# EAGLE design Arduino_Zero (EAGLE 9.6.2)
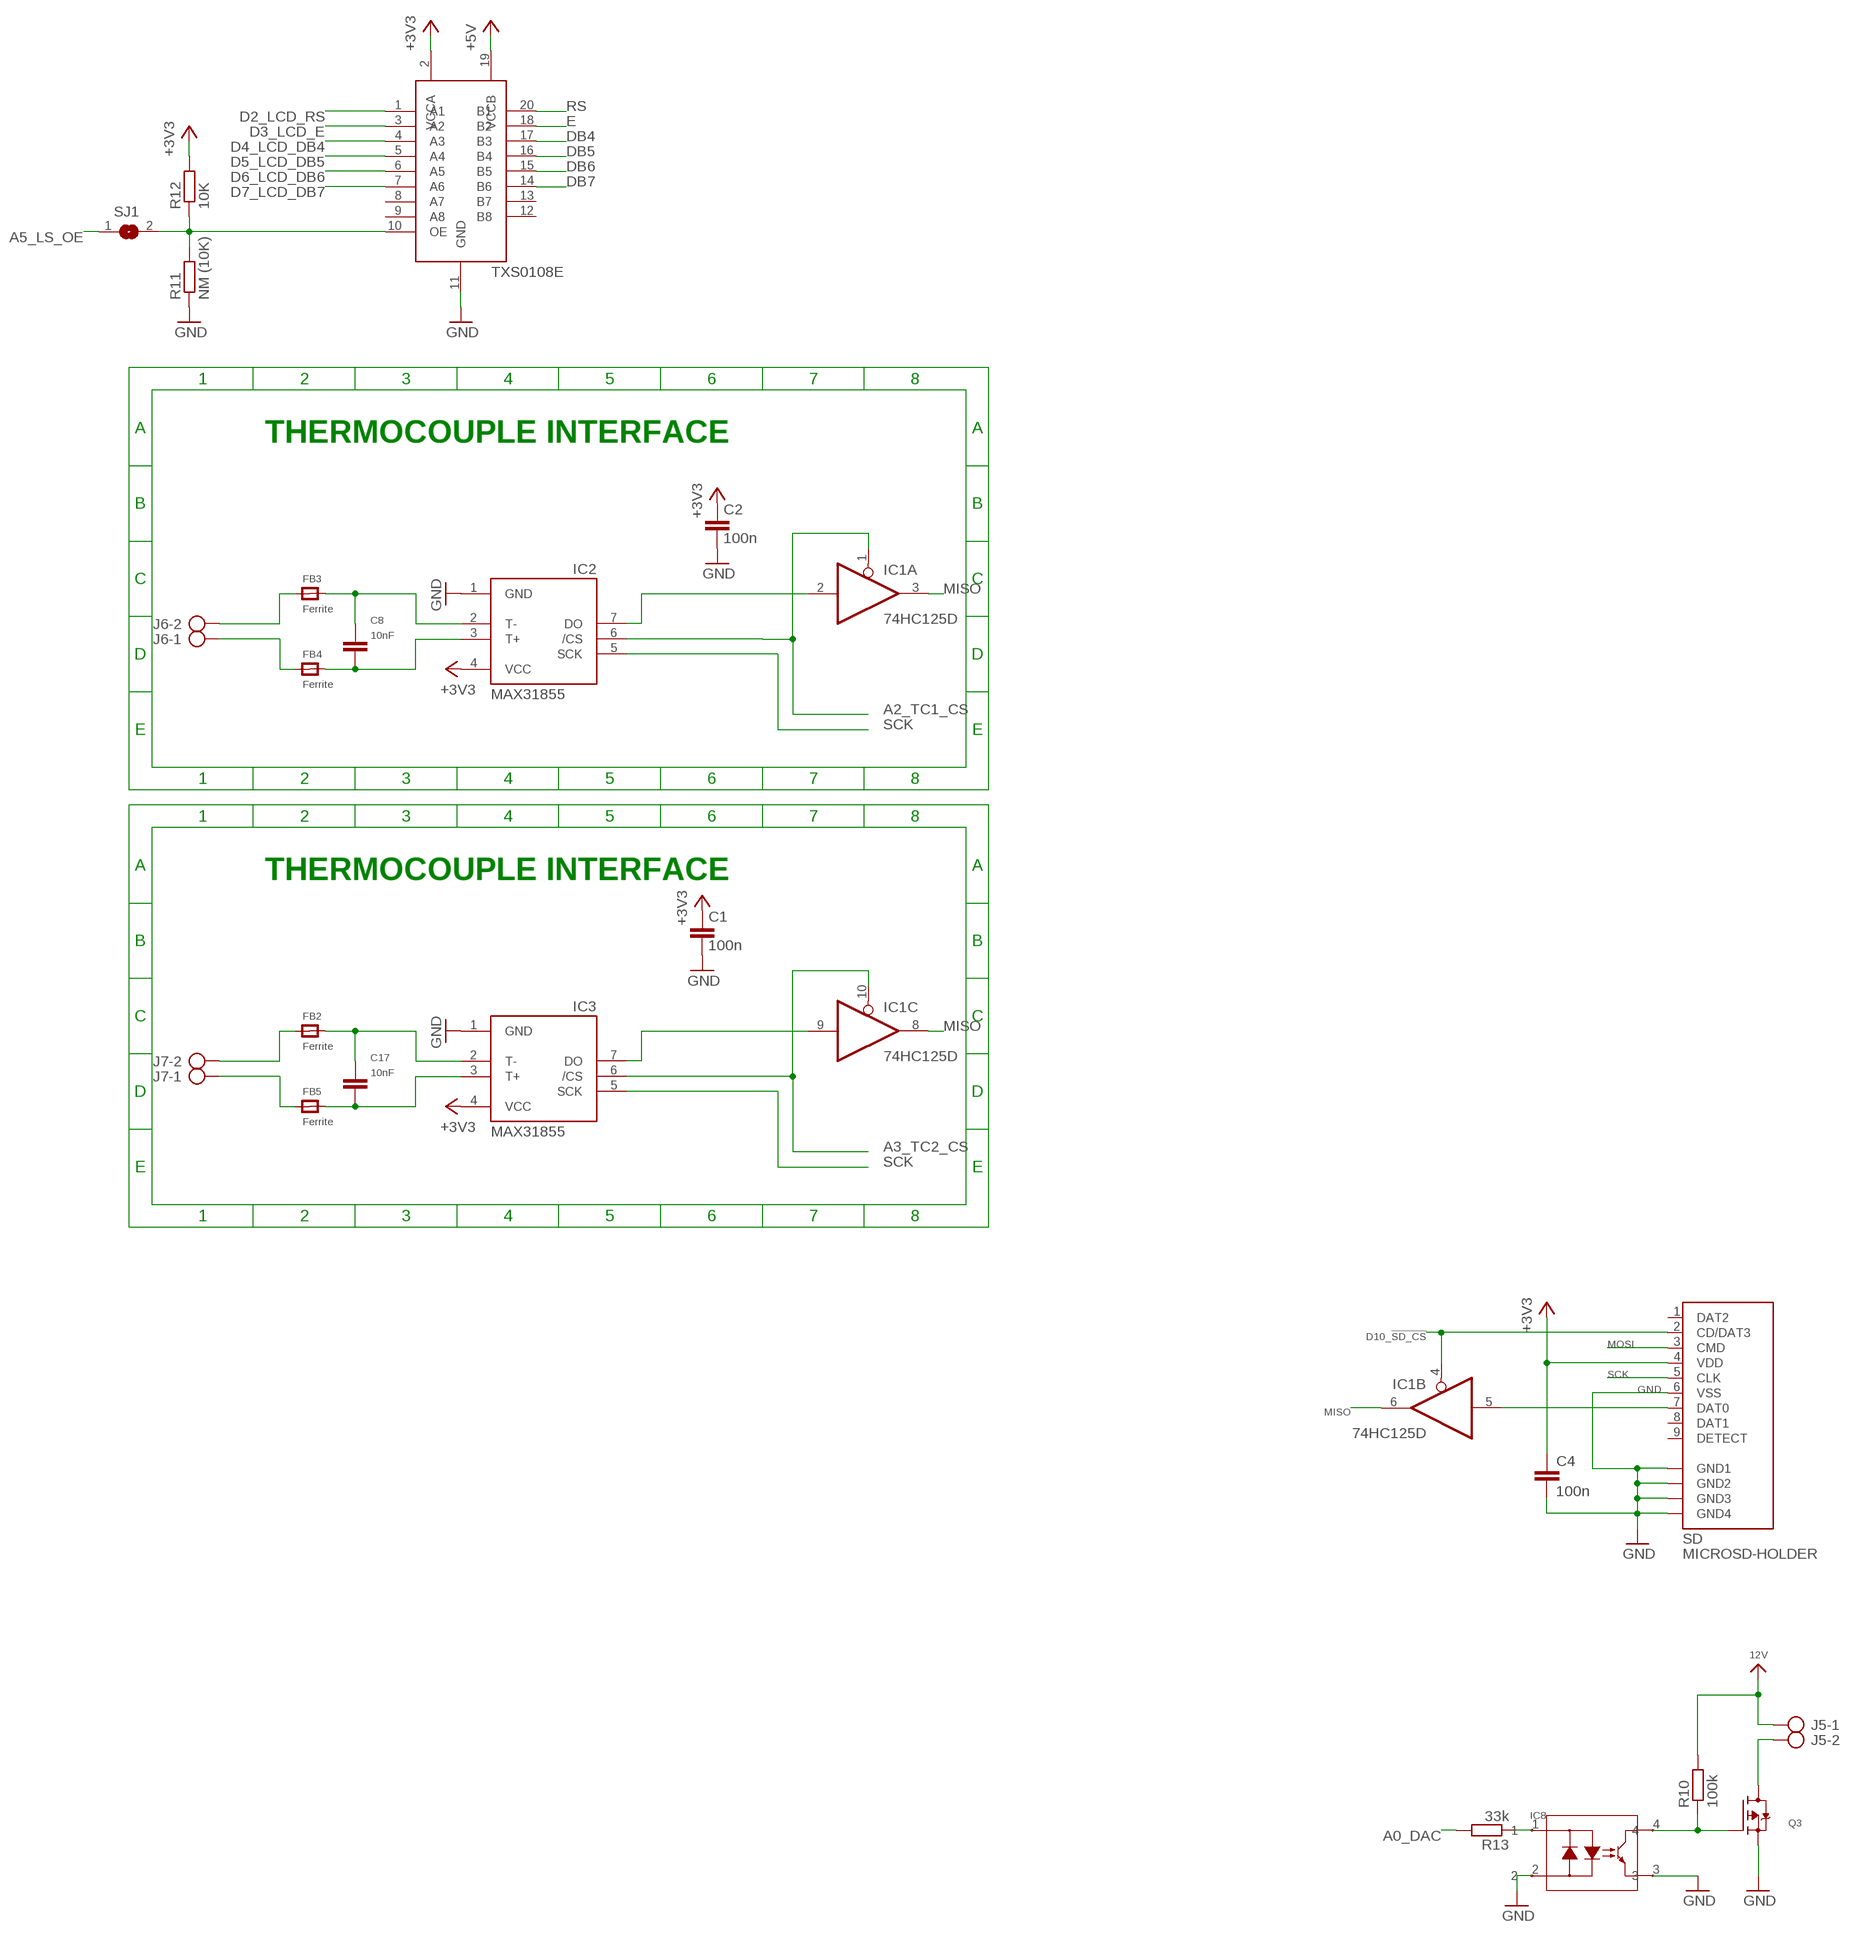
[diagram p0: schematic, sheet 1, part 1 of 2]
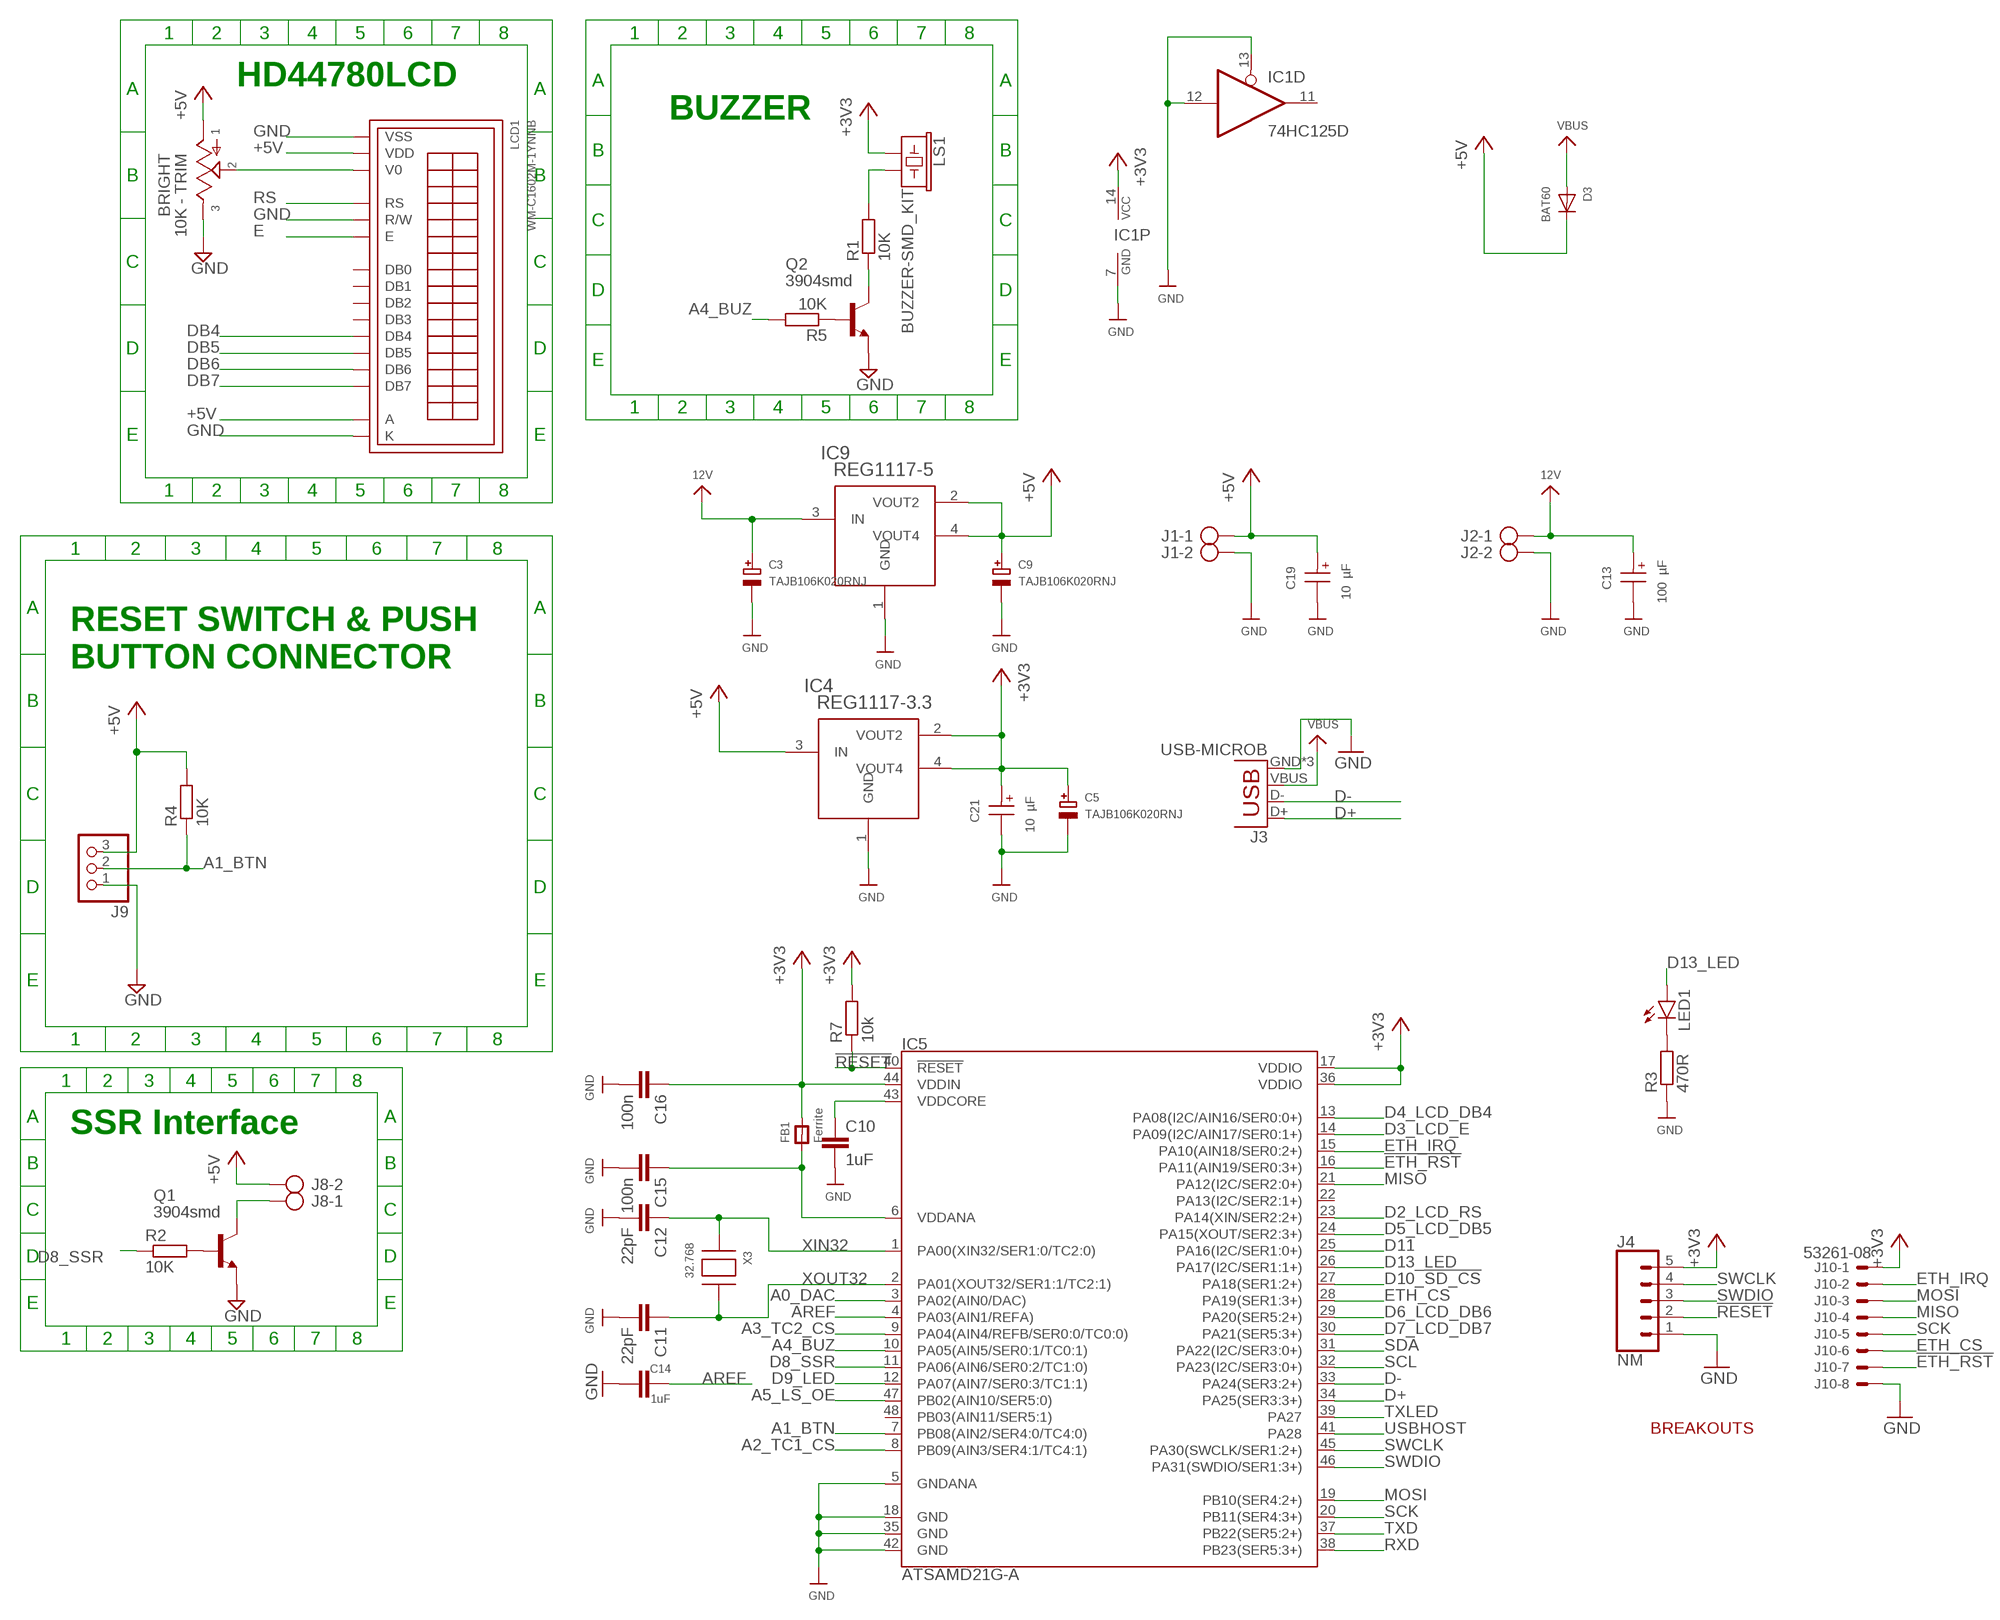
[diagram p1: schematic, sheet 1, part 2 of 2]

## Parts
BRIGHT  10K - TRIM  POTTRIM  [B25P]
C1  100n  C-EUC0603K  [C0603K]
C2  100n  C-EUC0603K  [C0603K]
C3  TAJB106K020RNJ  CAP_TANTALUM  [CAPMP3528X210N]
C4  100n  C-EUC0603K  [C0603K]
C5  TAJB106K020RNJ  CAP_TANTALUM  [CAPMP3528X210N]
C8  10nF  C-EUC0603K  [C0603K]
C9  TAJB106K020RNJ  CAP_TANTALUM  [CAPMP3528X210N]
C10  1uF  C-EUC0603K  [C0603K]
C11  22pF  C-EUC0603K  [C0603K]
C12  22pF  C-EUC0603K  [C0603K]
C13  100 µF  WCAP-ASLI_6.3X7.7_865080545012  [WCAP-ASLI_6.3X7.7(DXL)]
C14  1uF  C-EUC0603K  [C0603K]
C15  100n  C-EUC0603K  [C0603K]
C16  100n  C-EUC0603K  [C0603K]
C17  10nF  C-EUC0603K  [C0603K]
C19  10 µF  WCAP-ASLI_4X5.5_865080340001  [WCAP-ASLI_4X5.5(DXL)]
C21  10 µF  WCAP-ASLI_4X5.5_865080340001  [WCAP-ASLI_4X5.5(DXL)]
D3  BAT60  DIODESOD-323-3D  [SOD323]
FB1  Ferrite  FERRITEBEAD  [BEADC3216X100N]
FB2  Ferrite  FERRITEBEAD  [BEADC3216X100N]
FB3  Ferrite  FERRITEBEAD  [BEADC3216X100N]
FB4  Ferrite  FERRITEBEAD  [BEADC3216X100N]
FB5  Ferrite  FERRITEBEAD  [BEADC3216X100N]
IC1  74HC125D  [SO14]
IC2  MAX31855  MAX6675  [SO08]
IC3  MAX31855  MAX6675  [SO08]
IC4  REG1117-3.3  REG1117-5  [DCY0004A_N]
IC5  ATSAMD21G-A  [TQFP-48]
IC7  TXS0108E  [TSSOP20]
IC8  TLP283  TLP292  [SO4_TOS]
IC9  REG1117-5  [DCY0004A_N]
J1  AK500/2ASD  [AK500/2]
J2  AK500/2ASD  [AK500/2]
J3  USB-MICROB  [USB-MICROB]
J4  NM  CONN_051.27MM  [1X05_1.27MM]
J5  AK500/2ASD  [AK500/2]
J6  AK500/2ASD  [AK500/2]
J7  AK500/2ASD  [AK500/2]
J8  AK500/2ASD  [AK500/2]
J9  PINHD-1X3  [1X03]
J10  53261-08  [53261-08]
LCD1  WM-C1602M-1YNNB  [LCD_2]
LED1  LEDCHIPLED_0805  [CHIPLED_0805]
LS1  BUZZER-SMD_KIT  [BUZZER-CCV-KIT]
Q1  3904smd  BC850SMD  [SOT23-BEC]
Q2  3904smd  BC850SMD  [SOT23-BEC]
Q3  MOSFET-PWIDE  [SOT23-WIDE]
R1  10K  R-EU_R0603  [R0603]
R2  10K  R-EU_R0603  [R0603]
R3  470R  R-EU_R0603  [R0603]
R4  10K  R-EU_R0603  [R0603]
R5  10K  R-EU_R0603  [R0603]
R7  10k  R-EU_R0603  [R0603]
R10  100k  R-EU_R0603  [R0603]
R11  NM (10K)  R-EU_R0603  [R0603]
R12  10K  R-EU_R0603  [R0603]
R13  33k  R-EU_R0603  [R0603]
SD  MICROSD-HOLDER  [MICROSD-HOLDER-ALIEX]
SJ1  SJ  [SJ]
X3  32.768  XTAL-3.2X1.5  [XTAL3215]

## Nets
12V: C3.1(+) C13.1(+) IC9.3(IN) J2.1 J5.1 R10.2
!ETH_RST: IC5.16(PA11(AIN19/SER0:3+)) J10.7
!RESET: IC5.40(!RESET!) J4.2 R7.1
+3V3: C1.1 C2.1 C4.1 C5.1(+) C16.1 C21.1(+) FB1.2 IC1.14(P:VCC) IC2.4(VCC) IC3.4(VCC) IC4.2(VOUT2) IC4.4(VOUT4) IC5.17(VDDIO) IC5.36(VDDIO) IC5.44(VDDIN) IC7.2(VCCA) J4.5 J10.1 LS1.+ R7.2 R12.2 SD.4(VDD)
+5V: BRIGHT.1 C9.1(+) C19.1(+) D3.1(C) IC4.3(IN) IC7.19(VCCB) IC9.2(VOUT2) IC9.4(VOUT4) J1.1 J8.2 J9.3 LCD1.2(VDD) LCD1.15(A) R4.2
A0_DAC: IC5.3(PA02(AIN0/DAC)) R13.2
A1_BTN: IC5.7(PB08(AIN2/SER4:0/TC4:0)) J9.2 R4.1
A2_TC1_CS: IC1.1(A:OE) IC2.6(/CS) IC5.8(PB09(AIN3/SER4:1/TC4:1))
A3_TC2_CS: IC1.10(C:OE) IC3.6(/CS) IC5.9(PA04(AIN4/REFB/SER0:0/TC0:0))
A4_BUZ: IC5.10(PA05(AIN5/SER0:1/TC0:1)) R5.2
A5_LS_OE: IC5.47(PB02(AIN10/SER5:0)) SJ1.1
AREF: C14.1 IC5.4(PA03(AIN1/REFA))
D2_LCD_RS: IC5.23(PA14(XIN/SER2:2+)) IC7.1(A1)
D3_LCD_E: IC5.14(PA09(I2C/AIN17/SER0:1+)) IC7.3(A2)
D4_LCD_DB4: IC5.13(PA08(I2C/AIN16/SER0:0+)) IC7.4(A3)
D5_LCD_DB5: IC5.24(PA15(XOUT/SER2:3+)) IC7.5(A4)
D6_LCD_DB6: IC5.29(PA20(SER5:2+)) IC7.6(A5)
D7_LCD_DB7: IC5.30(PA21(SER5:3+)) IC7.7(A6)
D8_SSR: IC5.11(PA06(AIN6/SER0:2/TC1:0)) R2.1
D9_LED: IC5.12(PA07(AIN7/SER0:3/TC1:1))
D10_!SD_CS: IC1.4(B:OE) IC5.27(PA18(SER1:2+)) SD.2(CD/DAT3)
D11: IC5.25(PA16(I2C/SER1:0+))
D13_LED: IC5.26(PA17(I2C/SER1:1+)) LED1.A
D+: IC5.34(PA25(SER3:3+)) J3.D+
D-: IC5.33(PA24(SER3:2+)) J3.D-
DB4: IC7.17(B3) LCD1.11(DB4)
DB5: IC7.16(B4) LCD1.12(DB5)
DB6: IC7.15(B5) LCD1.13(DB6)
DB7: IC7.14(B6) LCD1.14(DB7)
E: IC7.18(B2) LCD1.6(E)
ETH_CS: IC5.28(PA19(SER1:3+)) J10.6
ETH_IRQ: IC5.15(PA10(AIN18/SER0:2+)) J10.2
GND: BRIGHT.3 C1.2 C2.2 C3.2(-) C4.2 C5.2(-) C9.2(-) C10.2 C11.2 C12.2 C13.2(-) C14.2 C15.2 C16.2 C19.2(-) C21.2(-) IC1.7(P:GND) IC1.12(D:I) IC1.13(D:OE) IC2.1(GND) IC3.1(GND) IC4.1(GND) IC5.5(GNDANA) IC5.18(GND) IC5.35(GND) IC5.42(GND) IC7.11(GND) IC8.2 IC8.3 IC9.1(GND) J1.2 J2.2 J3.GND J3.MT1(GND) J3.MT2(GND) J4.1 J9.1 J10.8 LCD1.1(VSS) LCD1.5(R/W) LCD1.16(K) Q1.E Q2.E Q3.2(S) R3.1 R11.1 SD.6(VSS) SD.P$1(GND1) SD.P$2(GND2) SD.P$3(GND3) SD.P$4(GND4)
MISO: IC1.3(A:O) IC1.6(B:O) IC1.8(C:O) IC5.21(PA12(I2C/SER2:0+)) J10.4
MOSI: IC5.19(PB10(SER4:2+)) J10.3 SD.3(CMD)
N$1: Q2.B R5.1
N$2: J8.1 Q1.C
N$3: Q1.B R2.2
N$4: LS1.- R1.2
N$5: BRIGHT.2 LCD1.3(V0)
N$6: LED1.C R3.2
N$7: IC1.2(A:I) IC2.7(DO)
N$8: IC1.5(B:I) SD.7(DAT0)
N$9: J5.2 Q3.3(D)
N$10: IC7.10(OE) R11.2 R12.1 SJ1.2
N$11: FB2.1 J7.2
N$12: IC8.1 R13.1
N$13: C17.1 FB2.2 IC3.2(T-)
N$14: IC8.4 Q3.1(G) R10.1
N$15: FB5.1 J7.1
N$16: C17.2 FB5.2 IC3.3(T+)
N$17: Q2.C R1.1
N$18: IC1.9(C:I) IC3.7(DO)
N$20: FB3.1 J6.2
N$21: C8.1 FB3.2 IC2.2(T-)
N$22: FB4.1 J6.1
N$27: C8.2 FB4.2 IC2.3(T+)
N$32: C15.1 FB1.1 IC5.6(VDDANA)
N$36: C10.1 IC5.43(VDDCORE)
RS: IC7.20(B1) LCD1.4(RS)
RXD: IC5.38(PB23(SER5:3+))
SCK: IC2.5(SCK) IC3.5(SCK) IC5.20(PB11(SER4:3+)) J10.5 SD.5(CLK)
SCL: IC5.32(PA23(I2C/SER3:0+))
SDA: IC5.31(PA22(I2C/SER3:0+))
SWCLK: IC5.45(PA30(SWCLK/SER1:2+)) J4.4
SWDIO: IC5.46(PA31(SWDIO/SER1:3+)) J4.3
TXD: IC5.37(PB22(SER5:2+))
TXLED: IC5.39(PA27)
USBHOST: IC5.41(PA28)
VBUS: D3.2(A) J3.VBUS
XIN32: C12.1 IC5.1(PA00(XIN32/SER1:0/TC2:0)) X3.P$1
XOUT32: C11.1 IC5.2(PA01(XOUT32/SER1:1/TC2:1)) X3.P$2
Unconnected: IC1.11(D:O) IC5.22(PA13(I2C/SER2:1+)) IC5.48(PB03(AIN11/SER5:1)) IC7.8(A7) IC7.9(A8) IC7.12(B8) IC7.13(B7) LCD1.7(DB0) LCD1.8(DB1) LCD1.9(DB2) LCD1.10(DB3) SD.1(DAT2) SD.8(DAT1) SD.9(DETECT)

## Notes on the sheet
- TXS0108E
- HD44780LCD
- BUZZER
- THERMOCOUPLE INTERFACE
- THERMOCOUPLE INTERFACE
- RESET SWITCH & PUSH
  BUTTON CONNECTOR
- SSR Interface
- BREAKOUTS

## Library data of the parts
BRIGHT = gm-pots:POT: Potentiometers the arrow indicates the clockwise motion of th wiper (lug 2) fully counter clockwise there is no resistance between lugs 1 and 2 fully clockwise the resistance between lugs 1 and 2 is the value of the pot
C1 C2 C4 C8 C10-C12 C14-C17 = rcl:C-EU: CAPACITOR, European symbol; SPICEPREFIX: C
C3 C5 C9 = microbuilder:CAP_TANTALUM: Tantalum Capacitors Wave footprints have larger pads and are meant to be used for hand soldering. Reflow footprints are optimised for solder paste and a reflow oven. EIA3216-18/A-[R/W] - Size A / 3216-18 / 1206 footprint 4.7µF 25V 10% Tantalum Capacitor 10µF 16V 10% Tantalum Capacitor [Digikey: 495-2236-2-ND] EIA3528-21/B-[R/W] - Size B / 3528-21 47µF 10V 10% Tantalum Capactior [Digikey: 495-2216-1-ND] EIA6032-28/C-[R/W] - Size C / 6032-28 10µF 35V 20% Tantalum Capacitor [Digikey: 495-2285-1-ND] 100µF 16V 10% Tantalum Capactior [Digikey: 399-5214-1-ND]
C13 = Wurth_Capacitors_WCAP-ASLI:WCAP-ASLI_6.3X7.7: WCAP-ASLI Aluminium Electrolytic Capacitors Low Impedance +105 °C Characteristics Low impedance product series Mounting style: V-Chip SMT Capacitance range: 0.1 µF ‒ 6800 µF Capacitance tolerance: ±20 % Voltage range (UR): 6.3 ‒ 100 V(DC) Operating temperature: -55 °C up to +105 °C Endurance: 2000 h @ +105 °C Dimensions (DxL) in mm: 4.0 x 5.5 up to 16.0 x 17.0 Recommended soldering: Reflow soldering Applications Low impedance, especially for filtering applications Input and output capacitor for switched-mode power supply Filtering Smoothing e.g. DC/DC converter, AC/DC converter, satellite receiver, control panel <https://www.we-online.com/catalog/media/o14723v209%20Family_WCAP-ASLI.jpg> Details see: https://www.we-online.com/catalog/en/WCAP-ASLI/ Updated by yingchun,Shan;2020-03-03 2020(C) Würth Elektronik; DATASHEET-URL: https://www.we-online.com/catalog/datasheet/865080545012.pdf; DF: 14%; DIAMETER: 6.3mm; I-LEAK: 35uA; I-RIPPLE: 300mA; L: 7.7mm; OPERATING-TEMPERATURE: -55 °C up to +105 °C; PART-NUMBER: 865080545012; TECHNICAL-REFERENCE: ASED077101M035DVCTCB000; VR: 35V(DC)
C19 C21 = Wurth_Capacitors_WCAP-ASLI:WCAP-ASLI_4X5.5: WCAP-ASLI Aluminium Electrolytic Capacitors Low Impedance +105 °C Characteristics Low impedance product series Mounting style: V-Chip SMT Capacitance range: 0.1 µF ‒ 6800 µF Capacitance tolerance: ±20 % Voltage range (UR): 6.3 ‒ 100 V(DC) Operating temperature: -55 °C up to +105 °C Endurance: 2000 h @ +105 °C Dimensions (DxL) in mm: 4.0 x 5.5 up to 16.0 x 17.0 Recommended soldering: Reflow soldering Applications Low impedance, especially for filtering applications Input and output capacitor for switched-mode power supply Filtering Smoothing e.g. DC/DC converter, AC/DC converter, satellite receiver, control panel <https://www.we-online.com/catalog/media/o14723v209%20Family_WCAP-ASLI.jpg> Details see: https://www.we-online.com/catalog/en/WCAP-ASLI/ Updated by yingchun,Shan;2020-03-02 2020(C) Würth Elektronik; DATASHEET-URL: https://www.we-online.com/catalog/datasheet/865080340001.pdf; DF: 16%; DIAMETER: 4mm; I-LEAK: 3uA; I-RIPPLE: 80mA; L: 5.5mm; OPERATING-TEMPERATURE: -55 °C up to +105 °C; PART-NUMBER: 865080340001; TECHNICAL-REFERENCE: ASEB055100M016DVCTAB000; VR: 16V(DC)
D3 = adafruit:DIODE: Diode SMADIODE - SMA Surface Mount Package 20V 1A Schottky Diode Digikey: 641-1014-6-ND DO-1N4148 - Through Hole Small Current Diode SOD-123 20V 1 A (.5mV Vf) Schottky Diode - Digikey: MBRX120TPMSCT-ND SOD-323 10V 570mA (.38mV Vf, 3ns) Schottky Diode - Digikey: ZLLS410CT-ND SOD-523 30V 30mA Schottky Diode (RB751S-40TE61) - Digikey: RB751S-40TE61CT-ND SOT23-R/W - SOT23 Package (R = Solder Paste/Reflow Ovens, W = Hand-Soldering) BAT54Film 40V 300mA - Digikey: 497-7162-1-ND
FB1-FB5 = microbuilder:FERRITE: Ferrite Bead 0603 MMZ1608B121C - 120 Ohm @ 100MHz, 600mA, 0.15 Ohm DC Resistance - Digikey: 445-2164-1-ND BK1608HW121-T - 120 Ohm, 600mA Ferrite Chip - Digikey: 587-1876-2-ND 0805 HZ0805B272R-10 - 2.7K Ohm @ 100MHz, 200mA, 0.8 Ohm DC Resistance - Digikey: 240-2504-1-ND (see also Murata BLM21BD272SN1L) MMZ2012Y152B - 1.5K Ohm @ 100MHz, 500mA, 0.4 Ohm DC Resistance - Digikey: 445-1560-1-ND - Mainly for high frequency (80-400MHz) MMZ2012R102A - 1K Ohm @ 100MHz, 500mA, 0.3 Ohm DC Resistance - Digikey: 445-1555-2-ND - More general purpose (10-200MHz)
IC1 = 74xx-eu:74*125: Quad bus BUFFER, 3-state
IC2 IC3 = adafruit:MAX6675
IC4 IC9 = gfe-hand-made:REG1117-5; COPYRIGHT: Copyright (C) 2022 Ultra Librarian. All rights reserved.; MANUFACTURER_PART_NUMBER: TLV1117-33CDCYR; MFR_NAME: Texas Instruments; REFDES: RefDes; TYPE: TYPE
IC5 = SparkFun-DigitalIC:ATSAMD21G: Atmel SAMD21G SMART ARM-Based Microcontroller The Atmel ® | SMART ™ SAM D21 is a series of low-power microcontrollers using the 32-bit ARM ® Cortex ® -M0+ processor, and ranging from 32- to 64-pins with up to 256KB Flash and 32KB of SRAM. The SAM D21 devices operate at a maximum frequency of 48MHz and reach 2.46 CoreMark/MHz. They are designed for simple and intuitive migration with identical peripheral modules, hex compatible code, identical linear address map and pin compatible migration paths between all devices in the product series. All devices include intelligent and flexible peripherals, Atmel Event System for inter-peripheral signaling, and support for capacitive touch button, slider and wheel user interfaces.; PROD_ID: IC-13064
IC7 = Synapseware:TXS0108E: 8-BIT BIDIRECTIONAL VOLTAGE-LEVEL TRANSLATOR FOR OPEN-DRAIN AND PUSH-PULL APPLICATIONS
IC8 = gfe-hand-made:TLP292; COPYRIGHT: Copyright (C) 2022 Ultra Librarian. All rights reserved.; MANUFACTURER_PART_NUMBER: TLP292; MFR_NAME: Toshiba Electronic Devices & Storage Co.
J1 J2 J5-J8 = con-ptr500:AK500/2: CONNECTOR
J3 = SparkFun-Connectors:USB: USB Connectors USB-B-PTH is fully proven SKU : PRT-00139/CONN-08278 USB-miniB is fully proven SKU : PRT-00587 USB-A-PCB is untested. USB-A-H is throughly reviewed, but untested. Spark Fun Electronics SKU : PRT-00437 USB-B-SMT is throughly reviewed, but untested. Needs silkscreen touching up. USB-A-S has not been used/tested USB-MB-H has not been used/tested USB-MICROB has been used. CONN-09505; PROD_ID: CONN-09505
J4 = SparkFun-Connectors:CONN_05: Multi connection point. Often used as Generic Header-pin footprint for 0.1 inch spaced/style header connections On any of the 0.1 inch spaced packages, you can populate with these: Break Away Headers - Straight <https://www.sparkfun.com/products/116> (PRT-00116) Break Away Male Headers - Right Angle <https://www.sparkfun.com/products/553> (PRT-00553) Female Headers <https://www.sparkfun.com/products/115> (PRT-00115) Break Away Headers - Machine Pin <https://www.sparkfun.com/products/117> (PRT-00117) Break Away Female Headers - Swiss Machine Pin <https://www.sparkfun.com/products/743> (PRT-00743) For SCREWTERMINALS and SPRING TERMINALS visit here: Screw Terimnals on SparkFun.com <https://www.sparkfun.com/search/results?term=Screw+Terminals> (5mm/3.5mm/2.54mm spacing) This device is also useful as a general connection point to wire up your design to another part of your project. Our various solder wires solder well into these plated through hole pads. Hook-Up Wire - Assortment (Stranded, 22 AWG) <https://www.sparkfun.com/products/11375> (PRT-11375) Hook-Up Wire - Assortment (Solid Core, 22 AWG) <https://www.sparkfun.com/products/11367> (PRT-11367) View the entire wire category on our website here <https://www.sparkfun.com/categories/141> Special notes: Molex polarized connector foot print use with SKU : PRT-08231 with associated crimp pins and housings. 1MM SMD Version SKU: PRT-10208
J9 = adafruit:PINHD-1X3: PIN HEADER
J10 = con-molex:53?-08: CONNECTOR wire to board 1.25 mm (.049 inch) pitch header; MF: MOLEX; OC_FARNELL: 1125376; OC_NEWARK: unknown
LCD1 = lcd:WM-C1602M-1YNNB: Display a cristalli liquidi tipo WM-C1602M WINTEK http://www.....
LED1 = led:LED: LED OSRAM: - CHIPLED LG R971, LG N971, LY N971, LG Q971, LY Q971, LO R971, LY R971 LH N974, LH R974 LS Q976, LO Q976, LY Q976 LO Q996 - Hyper CHIPLED LW Q18S LB Q993, LB Q99A, LB R99A - SideLED LS A670, LO A670, LY A670, LG A670, LP A670 LB A673, LV A673, LT A673, LW A673 LH A674 LY A675 LS A676, LA A676, LO A676, LY A676, LW A676 LS A679, LY A679, LG A679 - Hyper Micro SIDELED® LS Y876, LA Y876, LO Y876, LY Y876 LT Y87S - SmartLED LW L88C, LW L88S LB L89C, LB L89S, LG L890 LS L89K, LO L89K, LY L89K LS L896, LA L896, LO L896, LY L896 - TOPLED LS T670, LO T670, LY T670, LG T670, LP T670 LSG T670, LSP T670, LSY T670, LOP T670, LYG T670 LG T671, LOG T671, LSG T671 LB T673, LV T673, LT T673, LW T673 LH T674 LS T676, LA T676, LO T676, LY T676, LB T676, LH T676, LSB T676, LW T676 LB T67C, LV T67C, LT T67C, LS T67K, LO T67K, LY T67K, LW E67C LS E67B, LA E67B, LO E67B, LY E67B, LB E67C, LV E67C, LT E67C LW T67C LS T679, LY T679, LG T679 LS T770, LO T770, LY T770, LG T770, LP T770 LB T773, LV T773, LT T773, LW T773 LH T774 LS E675, LA E675, LY E675, LS T675 LS T776, LA T776, LO T776, LY T776, LB T776 LHGB T686 LT T68C, LB T68C - Hyper Mini TOPLED® LB M676 - Mini TOPLED Santana® LG M470 LS M47K, LO M47K, LY M47K Source: http://www.osram.convergy.de LUXEON: - LUMILED® LXK2-PW12-R00, LXK2-PW12-S00, LXK2-PW14-U00, LXK2-PW14-V00 LXK2-PM12-R00, LXK2-PM12-S00, LXK2-PM14-U00 LXK2-PE12-Q00, LXK2-PE12-R00, LXK2-PE12-S00, LXK2-PE14-T00, LXK2-PE14-U00 LXK2-PB12-K00, LXK2-PB12-L00, LXK2-PB12-M00, LXK2-PB14-N00, LXK2-PB14-P00, LXK2-PB14-Q00 LXK2-PR12-L00, LXK2-PR12-M00, LXK2-PR14-Q00, LXK2-PR14-R00 LXK2-PD12-Q00, LXK2-PD12-R00, LXK2-PD12-S00 LXK2-PH12-R00, LXK2-PH12-S00 LXK2-PL12-P00, LXK2-PL12-Q00, LXK2-PL12-R00 Source: www.luxeon.com KINGBRIGHT: KA-3528ASYC Source: www.kingbright.com
LS1 = SparkFun-Electromechanical:BUZZER: Buzzer Small round buzzers that operate around the audible 2kHz range. You can use these as speakers to create simple music or user interfaces. Variant Overview: PTH - Mini Speaker - PC Mount 12mm 2.048kHz <https://www.sparkfun.com/products/7950> PTH_KIT - Mini Speaker - PC Mount 12mm 2.048kHz <https://www.sparkfun.com/products/7950> KIT simplifies soldering by adding stop mask to one side of the pads. PTH_NO_SILK - Mini Speaker - PC Mount 12mm 2.048kHz <https://www.sparkfun.com/products/7950> No silkscreen indicator of buzzer outline. PTH_KIT_NO_SILK - Mini Speaker - PC Mount 12mm 2.048kHz <https://www.sparkfun.com/products/7950> KIT package w/o silkscreen SMD - Buzzer Audio Magnetic (CCV-084B16) SMD buzzer used on, e.g. the LilyPad Buzzer <https://www.sparkfun.com/products/8463> and RFID USB Reader <https://www.sparkfun.com/products/9963>. SMD_KIT - Buzzer Audio Magnetic (CCV-084B16) SMD Buzzer with elongated pins to make soldering easier. Used on the SparkFun Simon Says - Surface Mount Soldering Kit <https://www.sparkfun.com/products/10935>.; PROD_ID: COMP-08568
Q1 Q2 = transistor-npn:BC850*: NPN Transistor
Q3 = microbuilder:MOSFET-P: P-Channel Mosfet LEGEND VDS: Voltage Drain-Source ID: Drain Current RDS(ON): Drain-Source On-State Resistance VGS(TH): Gate-Source Threshold Voltage CISS: Drain-Source Input Capacitance SOT-23 Name VDS ID RDS(ON) VGS(TH) CISS Order Number IRLML5103 30V 760mA 600 mOhm -- 75pF @ 25V Digikey: IRLML5103PBFCT-ND IRLML6401 12V 4.3A 50 mOhm 950mV @ 250µA 830pF @ 10V Digikey: IRLML6401PBFTR-ND NTR0202PL 20V 400mA 800 mOhm 2.3V @ 250uA 70pF @ 5V Digikey: NTR0202PLT1GOSTR-ND NTR4101PT1G 20V 1.8A 85 mOhm 1.2V @ 250uA 675pF @ 10V Digikey: NTR4101PT1GOSCT-ND DMP2004K 20V 600mA 900 mOhm 1V @ 250uA 175pF @ 16V Digikey: DMP2004KDICT-ND PMV65XP 20V 3.9A 76 mOhm 950mV @ 1mA 725pF @ 20V Digikey: 568-2358-2-ND TO-252 Name VDS ID RDS(ON) VGS(TH) CISS Order Number AOD417 30V 25A 34 mOhm 3V @ 250µA 920pF @ 15V Digikey: 785-1106-2-ND
R1-R5 R7 R10-R13 = rcl:R-EU_: RESISTOR, European symbol; SPICEPREFIX: R
SD = gfe-hand-made:MICROSD-HOLDER
SJ1 = jumper:SJ: SMD solder JUMPER
X3 = adafruit2:XTAL: Low cost SMT crystals, no capacitors included http://www.ladyada.net/library/eagle

## Board
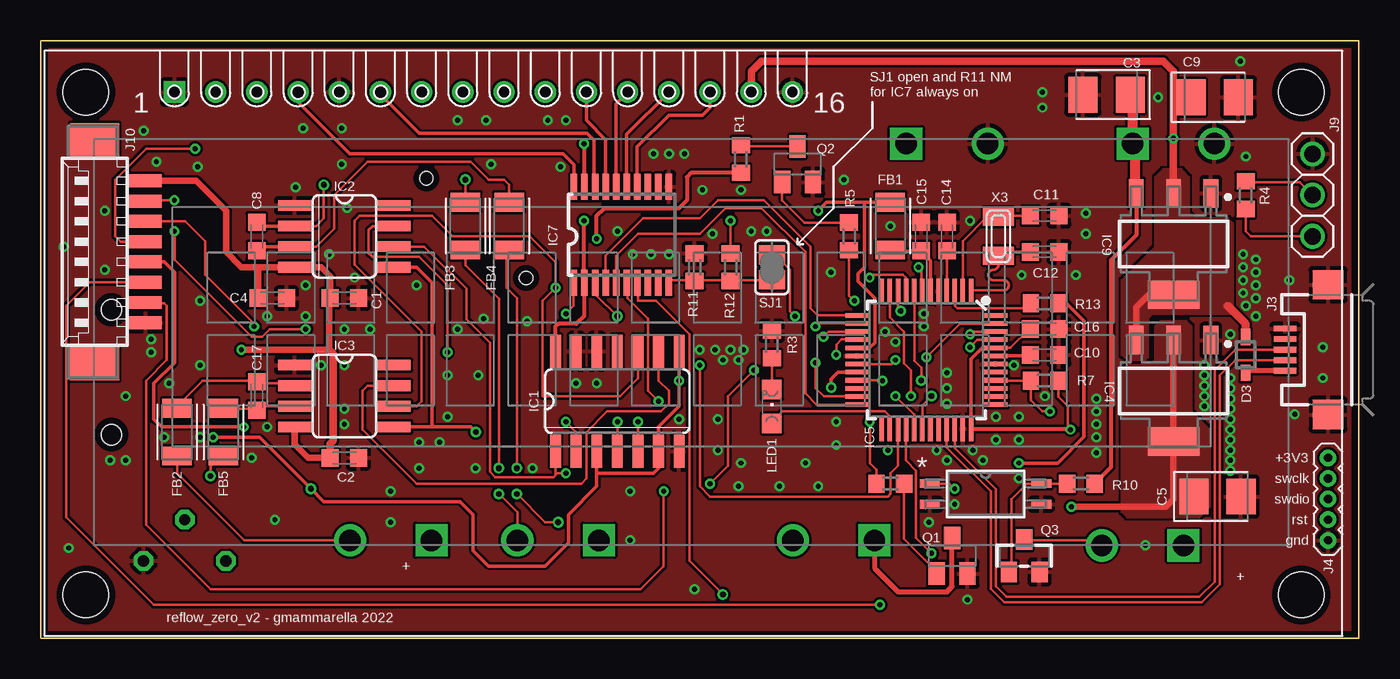
[diagram p2: board, top side]
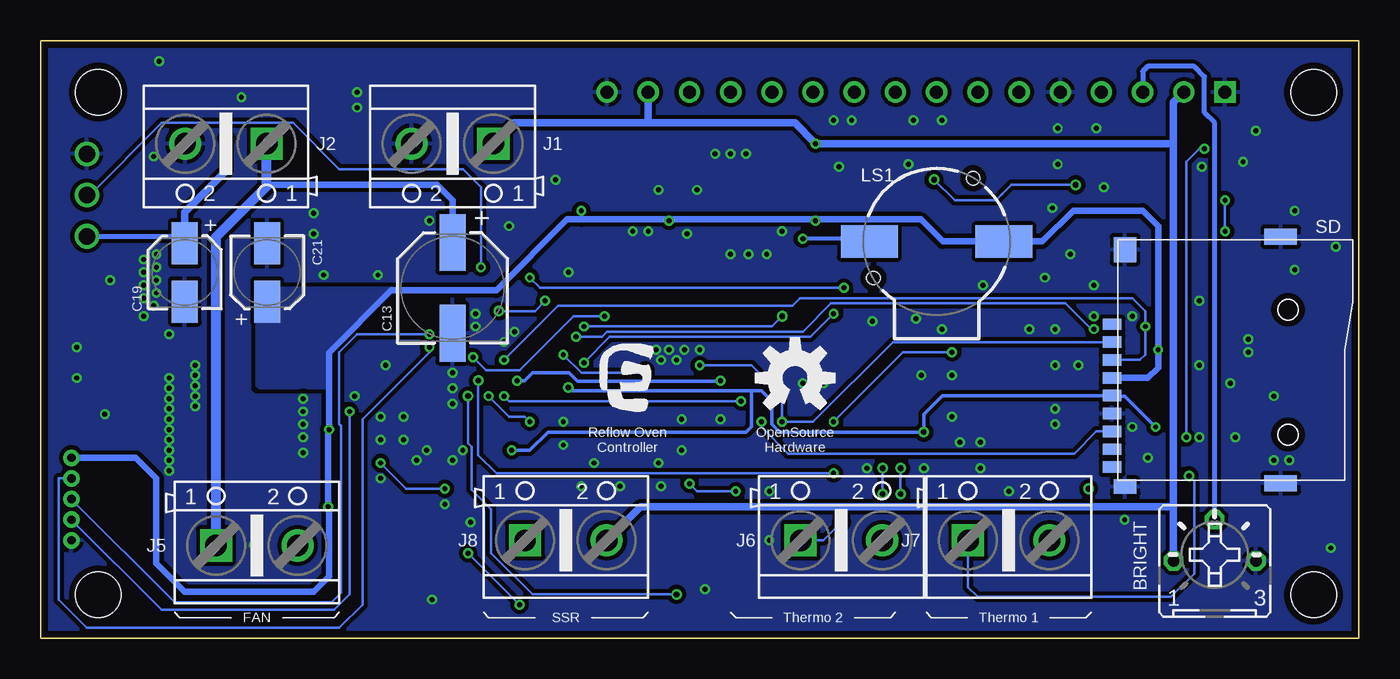
[diagram p3: board, bottom side, seen from below]

Size 81.28 x 36.83 mm. Coordinates in mm from the lower left corner, seen from the top.
Outline: 0,0 81.28,0 81.28,36.83 0,36.83 0,0
Copper layers (1*16): Top 0.035mm / dielectric 1.5mm / Bottom 0.035mm
Design rules "NOA Eagle Rule 2016-06-12": minimum track width 6mil, minimum drill 0.3mm, track to track 6mil, track to pad 6mil, pad to pad 6mil, via to via 6mil, smd to smd 0mil, copper to edge 0.4mm, drill to drill 10mil, minimum pad ring 10mil, minimum via ring 6mil, stop-mask expansion 2mil, vias tented up to drill 25mil, thermal gap 10mil

### Footprints (pad centres in the part's own frame; a part is rotated, then mirrored left to right if it is on the bottom)
B25P = drill 0.7 octagon: 1 -2.54,0; 2 0,2.54; 3 2.54,0
C0603K = smd 1.05 x 1.08: 1 -0.875,0; 2 0.875,0
CAPMP3528X210N = smd 1.796 x 2.204: 1 -1.46,0; 2 1.46,0
WCAP-ASLI_6.3X7.7(DXL) = smd 3.5 x 1.6: 1 2.8,0; 2 -2.8,0
WCAP-ASLI_4X5.5(DXL) = smd 2.6 x 1.6: 1 1.8,0; 2 -1.8,0
SOD323 = smd 1 x 0.6: 1 -1.1,0; 2 1.1,0
BEADC3216X100N = smd 1.165 x 1.815: 1 -1.475,0; 2 1.475,0
SO14 = smd 0.66 x 2.032: 1 -3.81,-3.073; 2 -2.54,-3.073; 3 -1.27,-3.073; 4 0,-3.073; 5 1.27,-3.073; 6 2.54,-3.073; 7 3.81,-3.073; 8 3.81,3.073; 9 2.54,3.073; 10 1.27,3.073; 11 0,3.073; 12 -1.27,3.073; 13 -2.54,3.073; 14 -3.81,3.073
SO08 = smd 0.66 x 2.032: 1 -1.905,-3.073; 2 -0.635,-3.073; 3 0.635,-3.073; 4 1.905,-3.073; 5 1.905,3.073; 6 0.635,3.073; 7 -0.635,3.073; 8 -1.905,3.073
DCY0004A_N = smd 1.75 x 0.9: 1 -3.125,2.3; 2 -3.125,0; 3 -3.125,-2.3 | smd 1.75 x 3.2: 4 3.125,0
TQFP-48 = smd 1.5 x 0.28: 1 -4.25,2.75; 2 -4.25,2.25; 3 -4.25,1.75; 4 -4.25,1.25; 5 -4.25,0.75; 6 -4.25,0.25; 7 -4.25,-0.25; 8 -4.25,-0.75; 9 -4.25,-1.25; 10 -4.25,-1.75; 11 -4.25,-2.25; 12 -4.25,-2.75; 25 4.25,-2.75; 26 4.25,-2.25; 27 4.25,-1.75; 28 4.25,-1.25; 29 4.25,-0.75; 30 4.25,-0.25; 31 4.25,0.25; 32 4.25,0.75; 33 4.25,1.25; 34 4.25,1.75; 35 4.25,2.25; 36 4.25,2.75 | smd 0.28 x 1.5: 13 -2.75,-4.25; 14 -2.25,-4.25; 15 -1.75,-4.25; 16 -1.25,-4.25; 17 -0.75,-4.25; 18 -0.25,-4.25; 19 0.25,-4.25; 20 0.75,-4.25; 21 1.25,-4.25; 22 1.75,-4.25; 23 2.25,-4.25; 24 2.75,-4.25; 37 2.75,4.25; 38 2.25,4.25; 39 1.75,4.25; 40 1.25,4.25; 41 0.75,4.25; 42 0.25,4.25; 43 -0.25,4.25; 44 -0.75,4.25; 45 -1.25,4.25; 46 -1.75,4.25; 47 -2.25,4.25; 48 -2.75,4.25
TSSOP20 = smd 0.4 x 1.6: 1 -2.675,-2.85; 2 -2.025,-2.85; 3 -1.375,-2.85; 4 -0.725,-2.85; 5 -0.075,-2.85; 6 0.575,-2.85; 7 1.225,-2.85; 8 1.875,-2.85; 9 2.525,-2.85; 10 3.175,-2.85; 11 3.175,3.05; 12 2.525,3.05; 13 1.875,3.05; 14 1.225,3.05; 15 0.575,3.05; 16 -0.075,3.05; 17 -0.725,3.05; 18 -1.375,3.05; 19 -2.025,3.05; 20 -2.675,3.05
SO4_TOS = smd 1.219 x 0.533: 1 -3.446,0.635; 2 -3.446,-0.635; 3 3.446,-0.635; 4 3.446,0.635
AK500/2 = drill 1.321 square: 1 -2.515,0 | drill 1.321: 2 2.515,0
USB-MICROB = smd 0.35 x 1.4: D+ 0,2.65; D- -0.65,2.65; GND 1.3,2.65; ID 0.65,2.65; VBUS -1.3,2.65 | smd 1.8 x 1.9: MT1 -4,0; MT2 4,0
1X05_1.27MM = drill 0.508 pad 1: 1 0,0; 2 1.27,0; 3 2.54,0; 4 3.81,0; 5 5.08,0
1X03 = drill 1.016: 1 -2.54,0; 2 0,0; 3 2.54,0
53261-08 = smd 0.8 x 2: 1 4.375,-2.5; 2 3.125,-2.5; 3 1.875,-2.5; 4 0.625,-2.5; 5 -0.625,-2.5; 6 -1.875,-2.5; 7 -3.125,-2.5; 8 -4.375,-2.5 | smd 2.1 x 3: S1 6.875,0.625; S2 -6.875,0.625
LCD_2 = drill 0.8 square: 1 0,0 | drill 0.8: 2 2.54,0; 3 5.08,0; 4 7.62,0; 5 10.16,0; 6 12.7,0; 7 15.24,0; 8 17.78,0; 9 20.32,0; 10 22.86,0; 11 25.4,0; 12 27.94,0; 13 30.48,0; 14 33.02,0; 15 35.56,0; 16 38.1,0 | hole 2.8: -5.461,0; -5.461,-30.988; 69.469,0; 69.469,-30.988
CHIPLED_0805 = smd 1.2 x 1.2: A 0,-1.05; C 0,1.05
BUZZER-CCV-KIT = smd 3.5 x 2: + 4.15,0; - -4.15,0 | hole 0.8: -3.9,-2.25; 2.25,3.9
SOT23-BEC = smd 1 x 1.4: B -0.95,-1.1; C 0,1.1; E 0.95,-1.1
SOT23-WIDE = smd 1 x 1.27: 1 -0.95,-1; 2 0.95,-1; 3 0,1
R0603 = smd 1 x 1.1: 1 -0.85,0; 2 0.85,0
MICROSD-HOLDER-ALIEX = smd 0.7 x 1.15: 1 2.2,7.6; 2 1.1,7.6; 3 0,7.6; 4 -1.1,7.6; 5 -2.2,7.6; 6 -3.3,7.6; 7 -4.4,7.6; 8 -5.5,7.6; 9 -6.6,7.6 | smd 1.55 x 1.4: P$1 6.8,6.8 | smd 1 x 2: P$2 7.6,-2.8; P$3 -7.6,-2.8 | smd 0.88 x 1.4: P$4 -7.8,6.8 | hole 1.25: -4.6,-3.25; 3.1,-3.25
SJ = smd 1.168 x 1.6: 1 -0.762,0; 2 0.762,0
XTAL3215 = smd 1.1 x 1.9: P$1 1.2,0; P$2 -1.2,0

### Placement (x,y rotation side)
BRIGHT  8.89,4.76 0 bottom
C1  18.73,20.95 0 top
C2  18.73,11.11 0 top
C3  65.72,33.5 180 top
C4  14.29,20.95 0 top
C5  72.55,8.73 0 top
C8  13.34,24.77 270 top
C9  72.39,33.34 0 top
C10  61.91,17.46 0 top
C11  61.91,26.04 0 top
C12  61.91,23.81 0 top
C13  55.88,21.59 90 bottom
C14  55.88,24.77 90 top
C15  54.29,24.77 90 top
C16  61.91,19.05 0 top
C17  13.34,14.92 270 top
C19  72.39,22.54 90 bottom
C21  67.31,22.54 270 bottom
D3  74.3,17.46 270 top
FB1  52.39,25.4 90 top
FB2  8.41,12.7 90 top
FB3  26.19,25.4 90 top
FB4  28.89,25.4 90 top
FB5  11.27,12.7 90 top
IC1  35.56,14.61 0 top
IC2  18.73,24.77 270 top
IC3  18.73,14.92 270 top
IC4  69.85,15.24 270 top
IC5  54.61,17.14 270 top
IC7  35.56,24.77 0 top
IC8  58.26,8.89 0 top
IC9  69.85,24.29 270 top
J1  55.88,30.48 180 bottom
J2  69.85,30.48 180 bottom
J3  79.38,17.78 90 top
J4  79.38,6.03 90 top
J5  67.94,5.71 0 bottom
J6  31.91,6.03 0 bottom
J7  21.59,6.03 0 bottom
J8  48.9,6.03 0 bottom
J9  78.42,27.3 270 top
J10  3.97,23.81 90 top
LCD1  8.26,33.66 0 top
LED1  45.09,14.29 0 top
LS1  26.04,24.45 0 bottom
Q1  56.2,5.08 0 top
Q2  46.67,29.21 0 top
Q3  60.64,5.08 0 top
R1  43.18,29.53 270 top
R2  52.39,9.53 0 top
R3  45.09,18.1 270 top
R4  74.3,27.3 270 top
R5  49.85,24.77 270 top
R7  61.91,15.88 0 top
R10  64.14,9.53 0 top
R11  40.32,22.86 270 top
R12  42.55,22.86 90 top
R13  61.91,20.64 180 top
SD  7.62,17.14 90 bottom
SJ1  45.09,22.86 270 top
U$1  [LOGO_PICCOLO]  46.83,13.97 0 bottom
U$2  [OSHW-LOGO-M]  34.77,16.03 0 bottom
X3  59.05,24.77 270 top

### Tracks (layer width: path | path; a pad name or v marks a point on that pad's centre or on a via)
12V
  Top 0.152: 67.47,30.48 J2.1 | IC9.3 67.47,27.5 67.47,27.62
  Top 0.254: R10.2 66.02,10.55 66.02,23.31 67.55,24.85 IC9.3
  Top 0.61: 67.47,30.48 67.47,27.62 67.47,27.3 | J2.1 67.33,33.34 C3.1
  Bottom 0.406: C13.1 55.88,26.99 56.83,27.94 67.33,27.94
  Bottom 0.61: J2.1 67.33,27.94 67.33,27.86 70.47,24.72 70.47,5.73 J5.1
!ETH_RST  (via drill 0.3)
  Top 0.152: v43.97,16.51 42.39,14.92 42.39,10.64 v41.27,9.53 | v38.42,9.05 38.42,4.45 36.99,3.02 10.48,3.02 6.51,6.99 6.51,15.88 7.78,17.14 7.78,20.48 7.62,20.64 6.51,20.64 J10.7 | IC5.16 50.32,18.41 49.37,18.41 49.05,18.1 v49.05,17.46
  Bottom 0.152: v49.05,17.46 47.94,16.35 44.13,16.35 v43.97,16.51 | v41.27,9.53 40.8,9.05 v38.42,9.05
!RESET  (via drill 0.3)
  Top 0.152: IC5.40 58.9,15.88 R7.1 61.06,14.66 61.75,13.97 v62.23,13.97
  Bottom 0.152: J4.2 73.82,1.75 63.18,1.75 62.23,2.7 v62.23,13.97
+3V3  (via drill 0.3)
  Top 0.152: C16.1 60.96,19.05 59.8,17.89 IC5.44 | v42.55,25.72 R12.2 | R7.2 62.76,14.87 63.34,14.29 63.34,12.89 | IC7.2 33.5,21.95
  Top 0.203: IC5.36 57.36,17.2 58.06,17.89 IC5.44 | IC5.17 51.11,17.89 51.44,18.22 51.44,20.96 50.4,22 50.4,22.45 50.8,22.85 50.8,26.88 | FB1.2 50.8,26.88 | 50.8,26.88 48.47,26.88 v47.94,26.35
  Top 0.254: IC1.14 31.75,19.21 31.91,19.37 33.02,19.37 33.53,19.88 IC7.2 | 33.5,21.95 v33.5,25.72 | IC5.36 63.34,12.89 63.38,12.86 v63.5,12.86
  Top 0.406: v63.55,8.1 69.37,8.1 69.85,8.57 IC4.4 IC4.2 | v12.38,17.78 17.8,17.78 17.8,20.9 C1.1 17.86,22.31 17.3,22.86 IC2.4 13.34,22.86 | IC3.4 15.66,11.96 16.51,11.11 C2.1 | 13.34,22.86 12.38,22.86 11.43,23.81 11.43,26.35 9.6,28.19 J10.1 | 13.34,22.86 13.41,22.78 C4.1
  Top 0.457: 17.8,17.78 18.05,17.54 18.05,12.17 17.86,11.98 C2.1
  Bottom 0.152: v42.55,25.72 42.55,25.8 | v33.5,25.72 33.5,25.8
  Bottom 0.203: v47.94,26.35 47.94,25.8
  Bottom 0.406: J4.5 75.41,11.11 74.14,9.84 74.14,4.6 72.39,2.86 64.45,2.86 63.5,3.81 63.5,8.04 v63.55,8.1 63.55,12.8 v63.5,12.86 63.5,17.6 59.67,21.43 53.18,21.43 48.81,25.8 47.94,25.8 42.55,25.8 33.5,25.8 27.02,25.8 25.66,24.45 LS1.+ 19.53,24.45 17.62,26.35 13.34,26.35 12.38,25.4 v12.38,17.78 12.38,16.67 13.01,16.05 SD.4
  pour Bottom (isolate 0.305, no thermals): 63.5,15.4 67.79,15.4 67.94,15.56 67.94,21.59 59.53,21.59 63.5,17.62
  pour Top (no thermals): 70.96,19.21 70.64,19.53 69.06,19.53 68.74,19.21 68.74,17.14 68.42,16.83 66.99,16.83 66.67,16.51 66.67,7.78 66.99,7.46 71.44,7.46 72.07,8.1 72.07,12.86 70.96,13.97
+5V  (via drill 0.3)
  Top 0.152: 33.53,30.44 v33.5,30.48 | R4.2 74.3,25.08 74.61,24.77 J9.3 | v69.83,30.8 69.85,30.77
  Top 0.254: IC7.19 33.53,30.44
  Top 0.406: 74.28,18.57 D3.1 | IC4.3 67.55,20.4 68.31,21.16 IC9.4
  Top 0.457: LCD1.15 43.81,34.92 44.45,35.56 69.22,35.56 69.83,34.95 69.83,33.18 | IC9.2 69.83,27.44 v69.83,30.8 69.83,33.18 | C9.1 70.77,33.18 69.83,33.18
  Top 0.508: D3.1 74.3,19.37 73.18,20.48
  Bottom 0.152: 46.35,6.03 J8.2
  Bottom 0.305: J9.3 72.81,24.77 C19.1
  Bottom 0.457: LCD1.15 43.81,31.75 | J1.1 52.09,31.75 43.81,31.75 | 43.81,31.75 34.77,31.75 v33.5,30.48 11.43,30.48 | BRIGHT.1 11.43,8.1 | 11.43,8.1 11.43,30.48 | 11.43,30.48 11.43,33.02 LCD1.2 | 46.35,6.03 44.29,8.1 11.43,8.1 | C19.1 72.39,26.25 69.83,28.81 v69.83,30.8
  pour Top (no thermals): 66.67,22.07 66.67,17.46 66.99,17.14 68.1,17.14 68.26,17.3 68.26,19.68 68.58,20 73.5,20 73.5,25.56 73.18,25.88 71.12,25.88 70.8,26.19 70.8,28.42 70.33,28.89 69.22,28.89 68.74,28.42 68.74,24.13
A0_DAC
  Top 0.152: R13.2 60.74,20.32 56.52,20.32 56.36,20.48 IC5.3
A1_BTN  (via drill 0.3)
  Top 0.152: R4.1 74.3,28.1 77.63,28.1 J9.2 | v54.13,22.86 54.29,22.7 54.29,21.43 IC5.7
  Bottom 0.152: J9.2 78.26,27.3 73.82,31.75 65.72,31.75 62.87,28.89 55.24,28.89 54.13,27.78 v54.13,22.86
A2_TC1_CS  (via drill 0.3, 0.35)
  Top 0.152: IC5.8 53.86,17.1 54.29,16.67 v54.29,15.88 | IC2.6 23.65,24.13 26.26,21.52 26.26,19.66 27.7,18.22 27.7,10.25 28.03,9.92 31.63,9.92 31.75,10.04 31.75,10.16 | IC1.1 31.75,10.16 | v32.38,10.16 31.75,10.16
  Bottom 0.152: v32.38,10.16 53.18,10.16 54.29,11.27 v54.29,15.88
A3_TC2_CS  (via drill 0.3)
  Top 0.152: v51.12,22.23 51.12,22.38 53.18,22.38 53.34,22.23 53.34,21.43 IC5.9 | IC1.10 36.83,16.03 35.72,14.92 30.96,14.92 30.96,20.8 v31.75,21.59 31.75,23.18 30.16,24.77 25.4,24.77 24.13,26.04 19.68,26.04 19.37,25.72 19.37,23.02 23.5,18.89 23.5,14.61 23.18,14.29 IC3.6
  Bottom 0.152: v51.12,22.23 50.48,21.59 v31.75,21.59
A4_BUZ  (via drill 0.3, 0.35)
  Top 0.152: R5.2 49.85,21.11 v50.16,20.8 | 52.86,21.27 IC5.10 52.86,20.32 v53.02,20.16
  Bottom 0.152: v50.16,20.8 50.8,20.16 v53.02,20.16
A5_LS_OE  (via drill 0.3)
  Top 0.152: v46.51,19.84 46.2,20.16 46.2,22.7 45.4,23.5 45.09,23.5 SJ1.1 | IC5.47 58.74,19.37 56.67,19.37 v54.61,17.3
  Bottom 0.152: v54.61,17.3 53.82,16.51 51.75,16.51 48.42,19.84 v46.51,19.84
AREF
  Top 0.152: C14.1 55.88,21.43 IC5.4
D2_LCD_RS  (via drill 0.3)
  Top 0.152: v32.38,20 32.86,20.48 32.86,21.91 IC7.1 | v47.78,16.99 47.78,15.4 48.29,14.89 IC5.23
  Bottom 0.152: v47.78,16.99 46.2,18.57 33.81,18.57 v32.38,20
D3_LCD_E  (via drill 0.3, 0.35)
  Top 0.152: IC7.3 34.29,21.91 34.29,21.11 v35.56,19.84 | IC5.14 47.97,19.39 v47.78,19.21
  Bottom 0.152: v47.78,19.21 36.2,19.21 v35.56,19.84
D4_LCD_DB4
  Top 0.152: IC7.4 34.84,23.56 37.15,25.88 40.64,25.88 41.75,26.99 44.61,26.99 47.47,24.13 47.47,20.32 47.89,19.89 IC5.13
D5_LCD_DB5
  Top 0.152: IC7.5 35.48,23.58 36.83,24.92 40.64,24.92 42.23,26.51 44.45,26.51 47.15,23.81 47.15,15.08 47.84,14.39 IC5.24
D6_LCD_DB6  (via drill 0.3)
  Top 0.152: v38.1,14.61 37.47,15.24 37.47,19.68 36.2,20.95 36.2,21.91 IC7.6 | IC5.29 53.86,13.77 v52.7,14.92
  Bottom 0.152: v52.7,14.92 52.39,14.61 v38.1,14.61
D7_LCD_DB7  (via drill 0.35)
  Top 0.152: IC7.7 36.83,21.91 36.83,20.8 37.94,20.8 40.01,18.73 40.01,4.76 v42.07,2.7 | IC5.30 54.36,14.36 v54.93,14.92
  Bottom 0.152: v54.93,14.92 54.93,12.03 54.71,11.81 54.71,9.15 53.5,7.94 53.5,5.24 50.96,2.7 v42.07,2.7
D8_SSR  (via drill 0.3)
  Top 0.152: v51.12,13.34 51.12,10.79 51.54,10.38 R2.1 | v53.66,14.92 53.66,16.51 53.24,16.93 53.24,18.89 52.36,19.77 IC5.11
  Bottom 0.152: v51.12,13.34 51.44,13.65 52.39,13.65 v53.66,14.92
D10_!SD_CS  (via drill 0.3)
  Top 0.152: v35.56,13.34 IC1.4 | IC5.27 52.86,12.86 52.86,10.64 52.39,10.16 52.39,8.89 52.23,8.73 41.27,8.73 40.64,9.37 v40.64,16.83
  Bottom 0.152: v40.64,16.83 37.47,16.83 35.56,14.92 v35.56,13.34 33.66,13.34 28.75,18.25 SD.2
D13_LED
  Top 0.152: IC5.26 52.36,13.68 52.07,13.97 45.74,13.97 45.09,13.31 LED1.A
D+
  Top 0.152: IC5.34 56.36,11.7 58.88,9.18 58.88,3.19 59.53,2.54 71.44,2.54 72.39,3.49 72.39,16.51 73.66,17.78 J3.D+
D-
  Top 0.152: IC5.33 55.86,11.77 58.58,9.05 58.58,3.06 59.42,2.22 71.6,2.22 72.71,3.33 72.71,16.19 73.64,17.13 J3.D-
DB4
  Top 0.203: IC7.17 34.84,30.73 33.66,31.91 LCD1.11
DB5
  Top 0.203: IC7.16 35.48,32.95 LCD1.12
DB6
  Top 0.203: IC7.15 36.13,31.05 LCD1.13
DB7
  Top 0.203: IC7.14 36.78,30.28 38.73,32.23 40.8,32.23 41.27,32.7 LCD1.14
E
  Top 0.152: IC7.18 34.14,27.86
  Top 0.203: 34.14,27.86 34.14,30.68 33.7,31.11 23.34,31.11 20.95,33.5 LCD1.6
ETH_CS  (via drill 0.3)
  Top 0.152: v54.93,5.24 53.98,6.19 53.98,10.32 53.34,10.95 53.34,12.86 IC5.28 | v51.75,2.06 6.99,2.06 1.59,7.46 1.59,20.48 3.05,21.94 J10.6
  Bottom 0.152: v51.75,2.06 v54.93,5.24
ETH_IRQ  (via drill 0.3)
  Top 0.152: v16.35,19.05 14.13,19.05 13.65,18.57 13.02,18.57 8.26,23.34 v8.26,25.08 | J10.2 6.52,26.99 v8.26,26.99 | IC5.15 48.58,18.89 v48.26,18.57
  Bottom 0.152: v48.26,18.57 46.67,18.57 46.35,18.89 34.29,18.89 32.54,20.64 18.1,20.64 16.51,19.05 v16.35,19.05 | v8.26,26.99 v8.26,25.08
GND  (via drill 0.3)
  other vias: 41.43,24.92 35.56,25.08 43.18,27.62 40.8,27.62 37.78,29.84 38.73,29.84 55.88,15.4 54.45,20 52.07,18.89 63.82,22.38 60.48,22.38 65.09,11.43 65.09,12.38 55.88,14.45 58.1,10.95 13.97,19.84 30,19.53 25.72,19.05 34.29,15.72 33.02,15.72 16.35,21.75 20.32,19.05 23.18,21.75 17.3,16.83 64.45,24.92 73.98,35.56 64.45,26.19 74.14,23.65 68.1,5.71 17.78,23.65 61.75,32.7 61.75,33.66 68.9,33.34 74.3,29.69 74.14,21.27 60.01,16.83 57.47,11.59 58.9,13.65 60.33,9.84 49.05,11.91 47.94,9.37 38.73,23.65 37.62,23.65 36.51,23.65 44.77,25.08 43.81,25.08 48.74,22.54 40.64,17.78 41.59,17.78 42.55,17.78 43.34,17.78 42.07,17.14 43.02,17.14 41.75,11.59 43.02,9.37 43.18,10.79 45.56,9.37 47.15,10.79 41.75,13.49 39.37,13.49 36.35,6.03 40.32,3.02 21.59,7.14 24.61,12.06 23.34,12.06 18.73,14.13 18.73,13.18 13.97,13.02 9.84,12.38 14.45,7.3 7.62,12.38 1.43,24.13 6.35,31.27 9.68,29.05 18.57,29.21 15.72,27.78 27.78,29.21 32.07,29.05 27.46,31.91 32.38,31.91 18.57,31.43 25.72,31.91 31.27,31.91 39.69,29.84 49.53,28.26 52.39,25.4 57.31,25.72 65.09,13.18 76.99,22.07 74.14,22.07 79.06,17.94 79.06,16.03 77.31,13.81 65.09,13.97 65.09,14.76 54.77,7.14 56.36,8.26 55.24,11.59 55.88,10.95 57.15,2.38 25.08,16.19 25.08,13.65 16.35,19.84 3.97,26.35 18.73,16.83 18.89,26.51 6.83,17.62 7.94,15.72 5.24,14.92 9.84,20.8 9.84,16.83 16.19,31.43 6.83,18.41 7.14,29.37 13.02,11.11 36.35,9.05 30.32,10.48 26.83,10.48 23.34,10.48 21.59,9.05 61.91,14.92 49.05,13.34 18.73,19.05 27.3,19.68 26.99,16.19 19.37,22.23 58.9,12.22 60.33,12.22 60.33,13.65 73.34,18.73 71.75,16.19 71.75,15.56 71.75,14.92 73.34,14.76 73.34,15.4 73.34,16.03 73.34,14.13 74.14,22.86 74.93,19.84 74.3,20.48 74.93,20.95 74.93,21.75 74.93,22.54 74.93,23.34 71.75,16.83 71.75,14.29 73.34,13.49 73.34,12.86 73.34,12.22 73.34,11.59 73.34,10.95 73.34,10.32 52.7,18.26 55.88,16.35 54.45,19.21 4.29,10.95 5.24,10.95 1.75,5.56 3.97,22.7
  pour Bottom (isolate 0.254, rank 2): -2.54,-2.54 83.82,-2.54 83.82,39.37 -2.54,39.37
  pour Top (rank 2): -5.74,45.72 88.27,45.72 88.27,-3.81 -6.35,-3.81 -6.35,-2.22
MISO  (via drill 0.3, 0.35)
  Top 0.152: IC1.3 34.29,10.16 | 6.35,24.45 J10.4 4.93,24.44 4.6,24.77 4.6,28.26 6.51,30.16 v9.53,30.16 | IC5.21 51.89,15.89 v51.91,15.88
  Top 0.203: IC1.8 v39.37,15.88 39.37,14.29 38.1,13.02 IC1.6 38.1,10.48 37.78,10.16 34.29,10.16 | v10.64,12.38 13.49,12.38 v16.67,9.21 17.46,8.41 25.88,8.41 26.67,7.62 26.67,5.4 27.62,4.45 31.11,4.45 32.54,5.87 32.54,7.62 34.29,9.37 IC1.3
  Bottom 0.152: v9.53,30.16 9.84,30.16 10.64,29.37 v10.64,12.38
  Bottom 0.203: v39.37,15.88 39.42,15.82 48.16,15.82 48.69,16.35 50.96,16.35 51.44,15.88 v51.91,15.88
MOSI  (via drill 0.3)
  Top 0.152: IC5.19 52.45,16.89 v52.7,17.14 | v13.18,19.21 13.18,19.37 10.16,22.38 10.16,24.45 8.92,25.69 J10.3
  Bottom 0.152: SD.3 13.49,17.14 13.18,17.46 v13.18,19.21 13.18,20.16 13.97,20.95 34.45,20.95 34.92,20.48 49.37,20.48 v52.7,17.14
N$1
  Top 0.152: Q2.B 45.74,28.11 45.72,28.09 45.72,26.99 47.09,25.61 R5.1
N$2
  Top 0.152: 56.2,6.03 Q1.C
  Top 0.305: 56.2,6.03 56.2,3.17 55.88,2.86 52.86,2.86 51.41,4.31 J8.1
N$3
  Top 0.152: Q1.B 55.24,4.13 53.24,6.13 R2.2
N$4  (via drill 0.3)
  Top 0.254: v34.29,24.61 34.29,26.04 34.77,26.51 39.37,26.51 39.85,26.99 39.85,28.42 40.11,28.68 R1.2
  Bottom 0.254: LS1.- 30.34,24.61 v34.29,24.61
N$5
  Bottom 0.305: BRIGHT.2 8.89,31.75 9.53,32.38 9.53,34.61 10.16,35.24 13.02,35.24 13.34,34.92 LCD1.3
N$6
  Top 0.152: R3.2 LED1.C
N$7  (via drill 0.3)
  Top 0.152: IC1.2 33.02,12.7 v32.38,13.34 | IC2.7 20.48,25.4 20.24,25.16 20.24,23.73 20.48,23.5 23.34,23.5 25.08,21.75 v25.08,17.62
  Bottom 0.152: v32.38,13.34 28.1,17.62 v25.08,17.62
N$8  (via drill 0.3)
  Top 0.152: v36.83,13.34 IC1.5
  Bottom 0.152: SD.7 16.19,12.74 17.56,11.38 35.19,11.38 36.83,13.02 v36.83,13.34
N$9
  Top 0.152: Q3.3 60.64,6.03 65.41,6.03 65.41,5.71 J5.2
N$10
  Top 0.152: 40.32,22.07 38.73,22.07 IC7.10 | 40.32,22.07 42.55,22.07 | 40.32,22.07 R11.2 | 42.55,22.07 45.09,22.07 SJ1.2 | 42.55,22.07 R12.1
N$11
  Top 0.152: J7.2 12.54,6.03 8.41,10.16 FB2.1
N$12  (via drill 0.3)
  Top 0.152: v56.36,9.21 56.04,9.53 IC8.1
  Top 0.203: R13.1 63.24,20.64 64.32,19.56 64.32,12.41 62.71,10.79 v60.33,10.79
  Bottom 0.152: v56.36,9.21 57.31,9.21 58.74,9.21 v60.33,10.79
N$13
  Top 0.152: IC3.2 15.56,15.56 15.56,15.72 13.34,15.72 C17.1 13.34,15.88 10,15.88 8.41,14.29 FB2.2
N$14
  Top 0.152: Q3.1 59.85,4.13 59.85,8.57 60.8,9.53 IC8.4 R10.1
N$15  (via drill 0.35)
  Top 0.152: v10.48,10 10.48,10.59 11.11,11.22 FB5.1
  Bottom 0.152: J7.1 24.11,3.15 23.5,2.54 11.59,2.54 10.16,3.97 10.16,9.68 v10.48,10
N$16
  Top 0.152: IC3.3 13.57,14.29 C17.2 13.34,14.13 11.27,14.13 FB5.2
N$17
  Top 0.152: R1.1 43.18,30.32 46.67,30.32 Q2.C
N$18
  Top 0.152: IC1.9 38.1,15.88 38.73,15.24 38.73,14.45 38.26,13.97 34.92,13.97 33.66,12.7 33.66,9.84 33.34,9.53 23.18,9.53 19.84,12.86 19.84,15.24 20.16,15.56 IC3.7
N$20  (via drill 0.35)
  Top 0.152: J6.2 29.39,7.75 v28.26,8.89 | v28.26,10.48 28.26,20.92 26.19,22.98 FB3.1
  Bottom 0.152: v28.26,8.89 v28.26,10.48
N$21  (via drill 0.35)
  Top 0.152: FB3.2 v26.19,28.26 | IC2.2 16.99,25.4 17.46,25.88 v17.46,27.94
  Top 0.203: IC2.2 13.57,25.4
  Top 0.305: 13.57,25.4 C8.1
  Bottom 0.152: v26.19,28.26 24.92,26.99 22.38,26.99 22.07,27.3 21.99,27.38 21.43,27.94 v17.46,27.94
N$22  (via drill 0.35)
  Top 0.152: v31.91,7.14 31.11,7.14 v29.37,8.89 | v29.37,10.48 29.37,20.95 28.73,21.59 28.73,23.77 FB4.1
  Bottom 0.152: J6.1 33.02,6.03 v31.91,7.14 | v29.37,8.89 v29.37,10.48
N$27
  Top 0.152: IC2.3 16.99,24.13 18.1,25.24 18.1,27.3 20.16,29.37 26.51,29.37 27.62,28.26 28.57,28.26 28.89,27.94 FB4.2
  Top 0.203: IC2.3 13.57,24.13
  Top 0.305: 13.57,24.13 C8.2
N$32
  Top 0.152: 54.29,23.81 C15.1 52.42,23.89 FB1.1
  Top 0.203: IC5.6 54.86,23.25 54.29,23.81
N$36
  Top 0.203: C10.1 60.97,17.39 IC5.43
RS
  Top 0.203: LCD1.4 15.88,33.02 19.05,29.84 32.23,29.84 32.88,29.19 IC7.20
SCK  (via drill 0.3, 0.35)
  Top 0.203: IC5.20 49.17,16.39 48.74,15.96 v48.74,15.45 | IC3.5 24.13,13.02 | 24.13,13.02 26.51,13.02 v26.83,12.7 | 24.13,13.02 24.13,21.91 23.18,22.86 IC2.5 | v12.54,13.02 7.46,13.02 6.99,13.49 6.99,15.72 8.26,16.99 8.26,22.54 7.61,23.19 J10.5
  Bottom 0.152: 15.08,14.92 SD.5
  Bottom 0.203: SD.5 25.7,14.95 26.83,13.81 v26.83,12.7 35.72,12.7 36.2,13.18 36.2,14.61 36.83,15.24 37.47,15.24 | v52.23,11.59 51.12,11.59 50.01,12.7 37.78,12.7 37.47,13.02 37.47,15.24 | v12.54,13.02 14.45,14.92 15.08,14.92 | v48.74,15.45 48.52,15.24 37.47,15.24
SWCLK  (via drill 0.3)
  Top 0.152: IC5.45 57.77,18.39 v57.31,17.94
  Bottom 0.152: J4.4 80.17,9.84 80.17,2.38 78.42,0.64 62.87,0.64 61.44,2.06 61.44,13.49 57.31,17.62 v57.31,17.94
SWDIO  (via drill 0.3)
  Top 0.152: IC5.46 58.42,18.89 57.47,18.89 v57.31,18.73
  Bottom 0.152: J4.3 73.03,2.22 63.34,2.22 62.76,2.81 62.76,13.08 62.87,13.19 62.87,17.62 61.75,18.73 v57.31,18.73
VBUS
  Top 0.305: J3.VBUS 74.41,16.48 D3.2
XIN32
  Top 0.152: C12.1 59.05,23.81 X3.P$1 59.05,23.02 arc-90 58.74,22.7 arc90 58.42,22.38 arc90 58.74,22.07 59.37,22.07 arc-90 59.69,21.75 arc-90 59.37,21.43 57.4,21.43 IC5.1
XOUT32
  Top 0.152: C11.1 59.05,26.04 X3.P$2 58.35,25.96 56.86,24.48 IC5.2

### Text on the board
tPlace: SJ1 open and R11 NM / for IC7 always on | +3V3 | swclk | swdio | rst | gnd | + | + | reflow_zero_v2 - gmammarella 2022
bPlace: OpenSource / Hardware | Reflow Oven / Controller | Thermo 1 | Thermo 2 | SSR | FAN